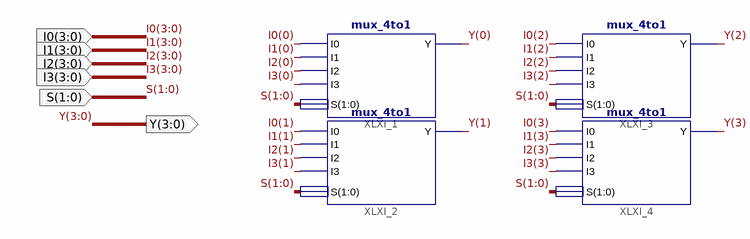
[diagram p0: schematic sheet 1]
// Xilinx ISE schematic mux_4bit_4to1.sch (virtex6) as structural Verilog: 4 symbols, 6 ports
module mux_4bit_4to1 (
  input  [1:0] S,
  input  [3:0] I0,
  input  [3:0] I1,
  input  [3:0] I2,
  input  [3:0] I3,
  output [3:0] Y
);

  mux_4to1 XLXI_1 (.S(S), .I3(I3[0]), .I2(I2[0]), .I1(I1[0]), .I0(I0[0]), .Y(Y[0]));
  mux_4to1 XLXI_2 (.S(S), .I3(I3[1]), .I2(I2[1]), .I1(I1[1]), .I0(I0[1]), .Y(Y[1]));
  mux_4to1 XLXI_3 (.S(S), .I3(I3[2]), .I2(I2[2]), .I1(I1[2]), .I0(I0[2]), .Y(Y[2]));
  mux_4to1 XLXI_4 (.S(S), .I3(I3[3]), .I2(I2[3]), .I1(I1[3]), .I0(I0[3]), .Y(Y[3]));
endmodule
